# Altium schematic sheet microSD.SchDoc
size A4
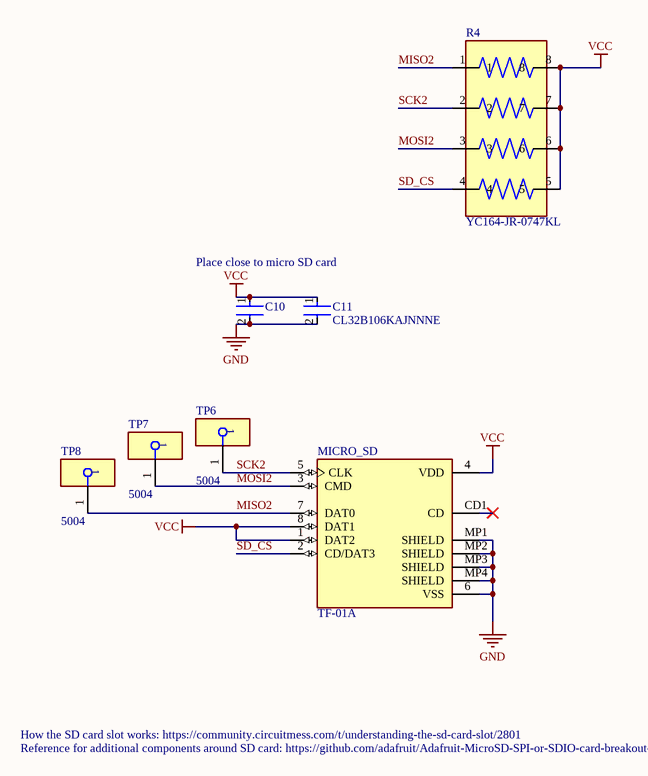
[diagram p0: microSD.SchDoc]

## Parts
C10  CC0603KRX7R9BB104  [FP-CC0603-DA-MFG]  (value not drawn)
C11  CL32B106KAJNNNE  [FP-CL32-IPC_B]
MICRO_SD  TF-01A  [TF-01A]
R4  YC164-JR-0747KL  [RESCAXE80P320X160X70-8N]
TP6  5004  [FP-5004-MFG]
TP7  5004  [FP-5004-MFG]
TP8  5004  [FP-5004-MFG]

## Nets
GND: C10.2 C11.2 MICRO_SD.6(VSS) MICRO_SD.MP1(SHIELD) MICRO_SD.MP2(SHIELD) MICRO_SD.MP3(SHIELD) MICRO_SD.MP4(SHIELD)
VCC: C10.1 C11.1 MICRO_SD.1(DAT2) MICRO_SD.4(VDD) MICRO_SD.8(DAT1) R4.5 R4.6 R4.7 R4.8
MISO2: MICRO_SD.7(DAT0) R4.1 TP8.1
MOSI2: MICRO_SD.3(CMD) R4.3 TP7.1
SCK2: MICRO_SD.5(CLK) R4.2 TP6.1
SD_CS: MICRO_SD.2(CD/DAT3) R4.4

Not connected (* = marked no-connect by the designer): MICRO_SD CD1(CD)*

## Notes on the sheet
- Place close to micro SD card
- How the SD card slot works: https://community.circuitmess.com/t/understanding-the-sd-card-slot/2801
- Reference for additional components around SD card: https://github.com/adafruit/Adafruit-MicroSD-SPI-or-SDIO-card-breakout-PCB

## Library data of the parts
C10 = CMP-2100-03601-2: CAP CER 0.1UF 50V X7R 0603; Manufacturer: YAGEO; Material: Ceramic; Capacitance: 100 nF; Temperature Coefficient: 15%; Tolerance: 0.1; Value: 100 nF; Height: 0.9mm; Voltage: 50 V; ComponentLink2Description: Datasheet; Device Class L2: Capacitors; Temperature Range High: +125°C; Category: Cap; Footprint Url: http://www.yageo.com/exep/pages/download/literatures/UPY-C_GEN_24.pdf; ComponentLink2URL: http://www.yageo.com/documents/recent/UPY-GPHC_X7R_6.3V-to-50V_18.pdf; Package: CC0603-DA; Temperature: -55°C to +125°C; Voltage Rating: 50 V; Temperature Characteristic: X7R; Device Class L1: Passive Components; Temperature Range Low: -55°C; Manufacturer Part Number: CC0603KRX7R9BB104; RoHS: TRUE; Automotive: No; Device Class L3: Ceramic Capacitors; Octopart: https://octopart.com/cc0603krx7r9bb104-yageo-42244635; Mouser Description: Multilayer Ceramic Capacitor, CC Series, 0.1 - F, - 10%, X7R, 50 V, 0603 [1608 Metric]; Lead Free: Yes; Digikey Description: CAP CER 0.1UF 50V X7R 0603; LCSC Part #: C14663
C11 = CMP-13271-001383-1: Cap Ceramic 10uF 25V X7R ±10% SMD 1210 +125°C Embossed T/R; Capacitance: 10uF; Width: 0.098inch; Min Operating Temperature: -55°C; Case Code (Metric): 3225; Case Code (Imperial): 1210; Material: Ceramic; Height: 2.5mm; Depth: 2.5mm; Contact Plating: Tin; Max Operating Temperature: 125°C; Length: 3.2mm; Mount: Surface Mount; Packaging: Tape and Reel; Dielectric: X7R; Tolerance: 10%; Radiation Hardening: No; Thickness: 0.106inch; Package Quantity: 1000; Voltage Rating: 25V; Voltage: 25V; Case/Package: 1210; LCSC Part #: C39232
MICRO_SD = TF-01A: Standard Card Edge Connectors; MF: HRO Electronics Co., Ltd.; Price: None; Availability: Not in stock; MP: TF-01A; Package: Package; SnapEDA_Link: https://www.snapeda.com/parts/TF-01A/HRO+Electronics+Co.%252C+Ltd./view-part/?ref=snap; Check_prices: https://www.snapeda.com/parts/TF-01A/HRO+Electronics+Co.%252C+Ltd./view-part/?ref=eda; Value: *; LCSC Part #: C91145
R4 = YC164-JR-0747KL: 47k Ohm Â±5% 62.5mW Power Per Element Isolated 4 Resistor Network/Array Â±200ppm/Â°C 1206 (3216 Metric), Convex, Long Side Terminals; MF: Yageo; SnapEDA_Link: https://www.snapeda.com/parts/YC164-JR-0747KL/Yageo/view-part/?ref=snap; Package: 1206 Yageo; Value: *; MP: YC164-JR-0747KL; Check_prices: https://www.snapeda.com/parts/YC164-JR-0747KL/Yageo/view-part/?ref=eda; LCSC Part #: C779384
TP6-TP8 = CMP-2000-05575-2: PC TEST POINT MINIATURE YELLOW; Manufacturer: Keystone; Number Of Contacts: 1; Is Female: yes; Device Class L1: Connectors; Manufacturer Part Number: 5004; Digikey Description: PC TEST POINT MINIATURE YELLOW; ComponentLink2URL: https://www.keyelco.com/product-pdf.cfm?p=1313; Lead Free: Yes; ComponentLink2Description: Datasheet; Category: Conn; Height: 4.72mm; Octopart: https://octopart.com/5004-keystone-28591; Mouser Description: TEST POINT PC MINI .040"D YELLOW; Device Class L3: unset; Contact Material: Silver; Package: 5004; Automotive: No; Device Class L2: unset; RoHS: TRUE